# Altium schematic sheet [04] - ARDUINO UNO (MEGA).SchDoc: Test title
size A4; Date: YYYY-MM-DD; Engineer: X; SheetNumber: 4; Size: A4
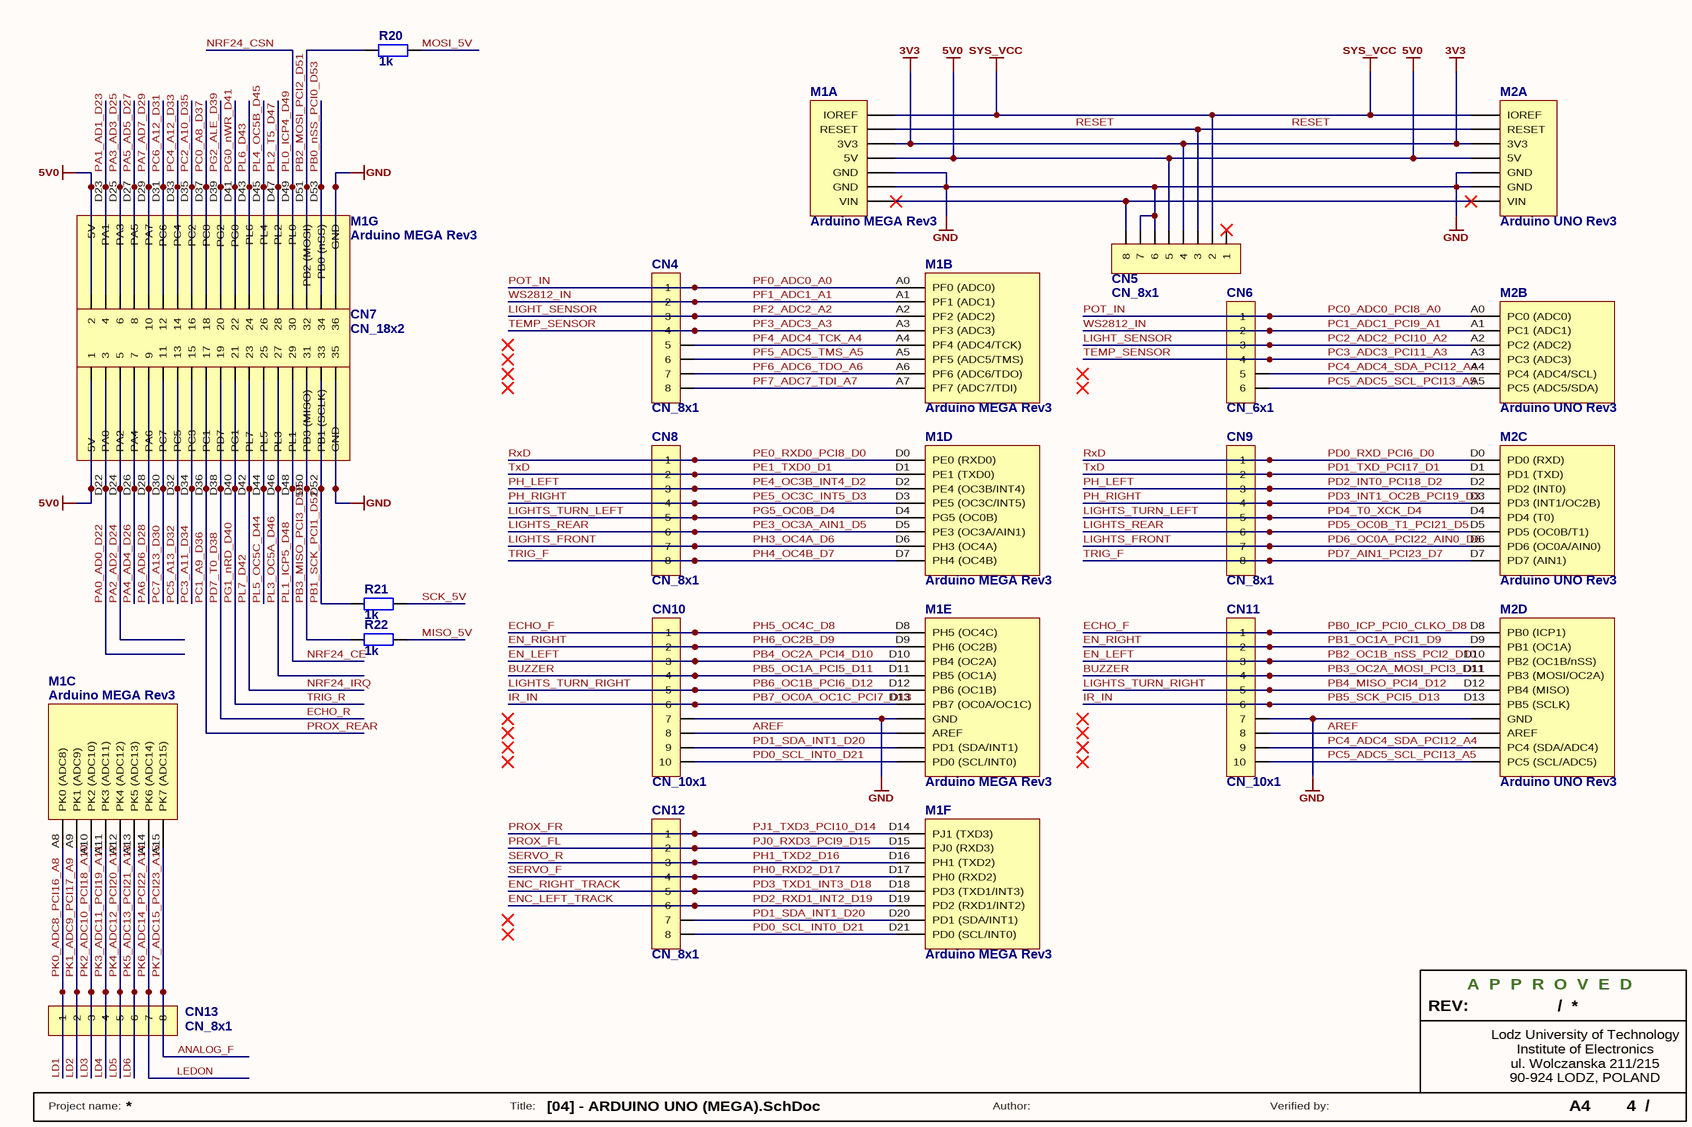
[diagram p0: [04] - ARDUINO UNO (MEGA).SchDoc]

## Parts
CN4  CN_8x1  [GP_8x1]
CN5  CN_8x1  [GP_8x1]
CN6  CN_6x1  [GP_6x1]
CN7  CN_18x2  [GP_18x2]
CN8  CN_8x1  [GP_8x1]
CN9  CN_8x1  [GP_8x1]
CN10  CN_10x1  [GP_10x1]
CN11  CN_10x1  [GP_10x1]
CN12  CN_8x1  [GP_8x1]
CN13  CN_8x1  [GP_8x1]
M1  Arduino MEGA Rev3  [Arduino_MEGA_UPSIDE_DOWN]  (parts A,B,C,D,E,F,G of 8)
M2  Arduino UNO Rev3  [Arduino_UNO_UPSIDE_DOWN]  (parts A,B,C,D of 5)
R20  1k  [R0805]
R21  1k  [R0805]
R22  1k  [R0805]

## Nets
3V3: CN5.4 M1.P4(3V3) M2.P4(3V3)
5V0: CN5.5 CN7.1 CN7.2 M1.5V M1.P5(5V) M2.P5(5V)
GND: CN5.6 CN5.7 CN7.35 CN7.36 CN10.7 CN11.7 M1.GND M1.P6(GND) M1.P7(GND) M2.GND M2.P6(GND) M2.P7(GND)
SYS_VCC: CN5.2 M1.P2(IOREF) M2.P2(IOREF)
ANALOG_F: CN13.8 M1.A15(PK7_(ADC15))  [also labelled PK7_ADC15_PCI23_A15]
AREF: CN10.8 CN11.8 M1.AREF M2.AREF
BUZZER: CN10.4 CN11.4 M1.D11(PB5_(OC1A)) M2.D11(PB3_(MOSI/OC2A))  [also labelled PB3_OC2A_MOSI_PCI3_D11, PB5_OC1A_PCI5_D11]
ECHO_F: CN10.1 CN11.1 M1.D8(PH5_(OC4C)) M2.D8(PB0_(ICP1))  [also labelled PB0_ICP_PCI0_CLKO_D8, PH5_OC4C_D8]
ECHO_R: CN7.19 M1.D38(PD7)  [also labelled PD7_T0_D38]
EN_LEFT: CN10.3 CN11.3 M1.D10(PB4_(OC2A)) M2.D10(PB2_(OC1B/nSS))  [also labelled PB2_OC1B_nSS_PCI2_D10, PB4_OC2A_PCI4_D10]
EN_RIGHT: CN10.2 CN11.2 M1.D9(PH6_(OC2B)) M2.D9(PB1_(OC1A))  [also labelled PB1_OC1A_PCI1_D9, PH6_OC2B_D9]
ENC_LEFT_TRACK: CN12.6 M1.D19(PD2_(RXD1/INT2))  [also labelled PD2_RXD1_INT2_D19]
ENC_RIGHT_TRACK: CN12.5 M1.D18(PD3_(TXD1/INT3))  [also labelled PD3_TXD1_INT3_D18]
IR_IN: CN10.6 CN11.6 M1.D13(PB7_(OC0A/OC1C)) M2.D13(PB5_(SCLK))  [also labelled PB5_SCK_PCI5_D13, PB7_OC0A_OC1C_PCI7_D13]
LD1: CN13.1 M1.A8(PK0_(ADC8))  [also labelled PK0_ADC8_PCI16_A8]
LD2: CN13.2 M1.A9(PK1_(ADC9))  [also labelled PK1_ADC9_PCI17_A9]
LD3: CN13.3 M1.A10(PK2_(ADC10))  [also labelled PK2_ADC10_PCI18_A10]
LD4: CN13.4 M1.A11(PK3_(ADC11))  [also labelled PK3_ADC11_PCI19_A11]
LD5: CN13.5 M1.A12(PK4_(ADC12))  [also labelled PK4_ADC12_PCI20_A12]
LD6: CN13.6 M1.A13(PK5_(ADC13))  [also labelled PK5_ADC13_PCI21_A13]
LEDON: CN13.7 M1.A14(PK6_(ADC14))  [also labelled PK6_ADC14_PCI22_A14]
LIGHT_SENSOR: CN4.3 CN6.3 M1.A2(PF2_(ADC2)) M2.A2(PC2_(ADC2))  [also labelled PC2_ADC2_PCI10_A2, PF2_ADC2_A2]
LIGHTS_FRONT: CN8.7 CN9.7 M1.D6(PH3_(OC4A)) M2.D6(PD6_(OC0A/AIN0))  [also labelled PD6_OC0A_PCI22_AIN0_D6, PH3_OC4A_D6]
LIGHTS_REAR: CN8.6 CN9.6 M1.D5(PE3_(OC3A/AIN1)) M2.D5(PD5_(OC0B/T1))  [also labelled PD5_OC0B_T1_PCI21_D5, PE3_OC3A_AIN1_D5]
LIGHTS_TURN_LEFT: CN8.5 CN9.5 M1.D4(PG5_(OC0B)) M2.D4(PD4_(T0))  [also labelled PD4_T0_XCK_D4, PG5_OC0B_D4]
LIGHTS_TURN_RIGHT: CN10.5 CN11.5 M1.D12(PB6_(OC1B)) M2.D12(PB4_(MISO))  [also labelled PB4_MISO_PCI4_D12, PB6_OC1B_PCI6_D12]
MISO_5V: R22.2
MOSI_5V: R20.1
NRF24_CE: CN7.29 M1.D48(PL1)  [also labelled PL1_ICP5_D48]
NRF24_CSN: CN7.30 M1.D49(PL0)  [also labelled PL0_ICP4_D49]
NRF24_IRQ: CN7.23 M1.D42(PL7)  [also labelled PL7_D42]
PA0_AD0_D22: CN7.3 M1.D22(PA0)
PA1_AD1_D23: CN7.4 M1.D23(PA1)
PA2_AD2_D24: CN7.5 M1.D24(PA2)
PA3_AD3_D25: CN7.6 M1.D25(PA3)
PA4_AD4_D26: CN7.7 M1.D26(PA4)
PA5_AD5_D27: CN7.8 M1.D27(PA5)
PA6_AD6_D28: CN7.9 M1.D28(PA6)
PA7_AD7_D29: CN7.10 M1.D29(PA7)
PB0_nSS_PCI0_D53: CN7.34 M1.D53(PB0_(nSS))
PB1_SCK_PCI1_D52: CN7.33 M1.D52(PB1_(SCLK)) R21.1
PB2_MOSI_PCI2_D51: CN7.32 M1.D51(PB2_(MOSI)) R20.2
PB3_MISO_PCI3_D50: CN7.31 M1.D50(PB3_(MISO)) R22.1
PC0_A8_D37: CN7.18 M1.D37(PC0)
PC0_ADC0_PCI8_A0: CN4.1 CN6.1 M1.A0(PF0_(ADC0)) M2.A0(PC0_(ADC0))  [also labelled PF0_ADC0_A0, POT_IN]
PC1_A9_D36: CN7.17 M1.D36(PC1)  [also labelled PROX_REAR]
PC1_ADC1_PCI9_A1: CN4.2 CN6.2 M1.A1(PF1_(ADC1)) M2.A1(PC1_(ADC1))  [also labelled PF1_ADC1_A1, WS2812_IN]
PC2_A10_D35: CN7.16 M1.D35(PC2)
PC3_A11_D34: CN7.15 M1.D34(PC3)
PC3_ADC3_PCI11_A3: CN4.4 CN6.4 M1.A3(PF3_(ADC3)) M2.A3(PC3_(ADC3))  [also labelled PF3_ADC3_A3, TEMP_SENSOR]
PC4_A12_D33: CN7.14 M1.D33(PC4)
PC4_ADC4_SDA_PCI12_A4: CN6.5 CN11.9 M2.A4(PC4_(ADC4/SCL)) M2.SDA(PC4_(SDA/ADC4))
PC5_A13_D32: CN7.13 M1.D32(PC5)
PC5_ADC5_SCL_PCI13_A5: CN6.6 CN11.10 M2.A5(PC5_(ADC5/SDA)) M2.SCL(PC5_(SCL/ADC5))
PC6_A12_D31: CN7.12 M1.D31(PC6)
PC7_A13_D30: CN7.11 M1.D30(PC7)
PD0_RXD_PCI6_D0: CN8.1 CN9.1 M1.D0(PE0_(RXD0)) M2.D0(PD0_(RXD))  [also labelled PE0_RXD0_PCI8_D0, RxD]
PD0_SCL_INT0_D21: CN10.10 CN12.8 M1.D21(PD0_(SCL/INT0)) M1.SCL(PD0_(SCL/INT0))
PD1_SDA_INT1_D20: CN10.9 CN12.7 M1.D20(PD1_(SDA/INT1)) M1.SDA(PD1_(SDA/INT1))
PD1_TXD_PCI17_D1: CN8.2 CN9.2 M1.D1(PE1_(TXD0)) M2.D1(PD1_(TXD))  [also labelled PE1_TXD0_D1, TxD]
PD2_INT0_PCI18_D2: CN8.3 CN9.3 M1.D2(PE4_(OC3B/INT4)) M2.D2(PD2_(INT0))  [also labelled PE4_OC3B_INT4_D2, PH_LEFT]
PD3_INT1_OC2B_PCI19_D3: CN8.4 CN9.4 M1.D3(PE5_(OC3C/INT5)) M2.D3(PD3_(INT1/OC2B))  [also labelled PE5_OC3C_INT5_D3, PH_RIGHT]
PD7_AIN1_PCI23_D7: CN8.8 CN9.8 M1.D7(PH4_(OC4B)) M2.D7(PD7_(AIN1))  [also labelled PH4_OC4B_D7, TRIG_F]
PF4_ADC4_TCK_A4: CN4.5 M1.A4(PF4_(ADC4/TCK))
PF5_ADC5_TMS_A5: CN4.6 M1.A5(PF5_(ADC5/TMS))
PF6_ADC6_TDO_A6: CN4.7 M1.A6(PF6_(ADC6/TDO))
PF7_ADC7_TDI_A7: CN4.8 M1.A7(PF7_(ADC7/TDI))
PG0_nWR_D41: CN7.22 M1.D41(PG0)
PG1_nRD_D40: CN7.21 M1.D40(PG1)  [also labelled TRIG_R]
PG2_ALE_D39: CN7.20 M1.D39(PG2)
PH0_RXD2_D17: CN12.4 M1.D17(PH0_(RXD2))  [also labelled SERVO_F]
PH1_TXD2_D16: CN12.3 M1.D16(PH1_(TXD2))  [also labelled SERVO_R]
PJ0_RXD3_PCI9_D15: CN12.2 M1.D15(PJ0_(RXD3))  [also labelled PROX_FL]
PJ1_TXD3_PCI10_D14: CN12.1 M1.D14(PJ1_(TXD3))  [also labelled PROX_FR]
PL2_T5_D47: CN7.28 M1.D47(PL2)
PL3_OC5A_D46: CN7.27 M1.D46(PL3)
PL4_OC5B_D45: CN7.26 M1.D45(PL4)
PL5_OC5C_D44: CN7.25 M1.D44(PL5)
PL6_D43: CN7.24 M1.D43(PL6)
RESET: CN5.3 M1.P3(RESET) M2.P3(RESET)
SCK_5V: R21.2
NetCN5_8: CN5.8 M1.P8(VIN) M2.P8(VIN)

Not connected (* = marked no-connect by the designer): CN5 1*

## Notes on the sheet
- REV:
- A  P  P  R  O  V  E  D
- /
- Lodz University of Technology
- ul. Wolczanska 211/215
- 90-924 LODZ, POLAND
- Institute of Electronics
- Project name:
- Title:
- Author:
- Verified by:

## Library data of the parts
M1 = Arduino MEGA Rev3: Arduino MEGA Rev3 Board
M2 = Arduino UNO Rev3: Arduino UNO Rev3 Board
R20-R22 = Res: Resistor; Published: 19-Feb-2006; ComponentLink1Description: datasheet; ComponentLink2Description: supplier; Value: 1k